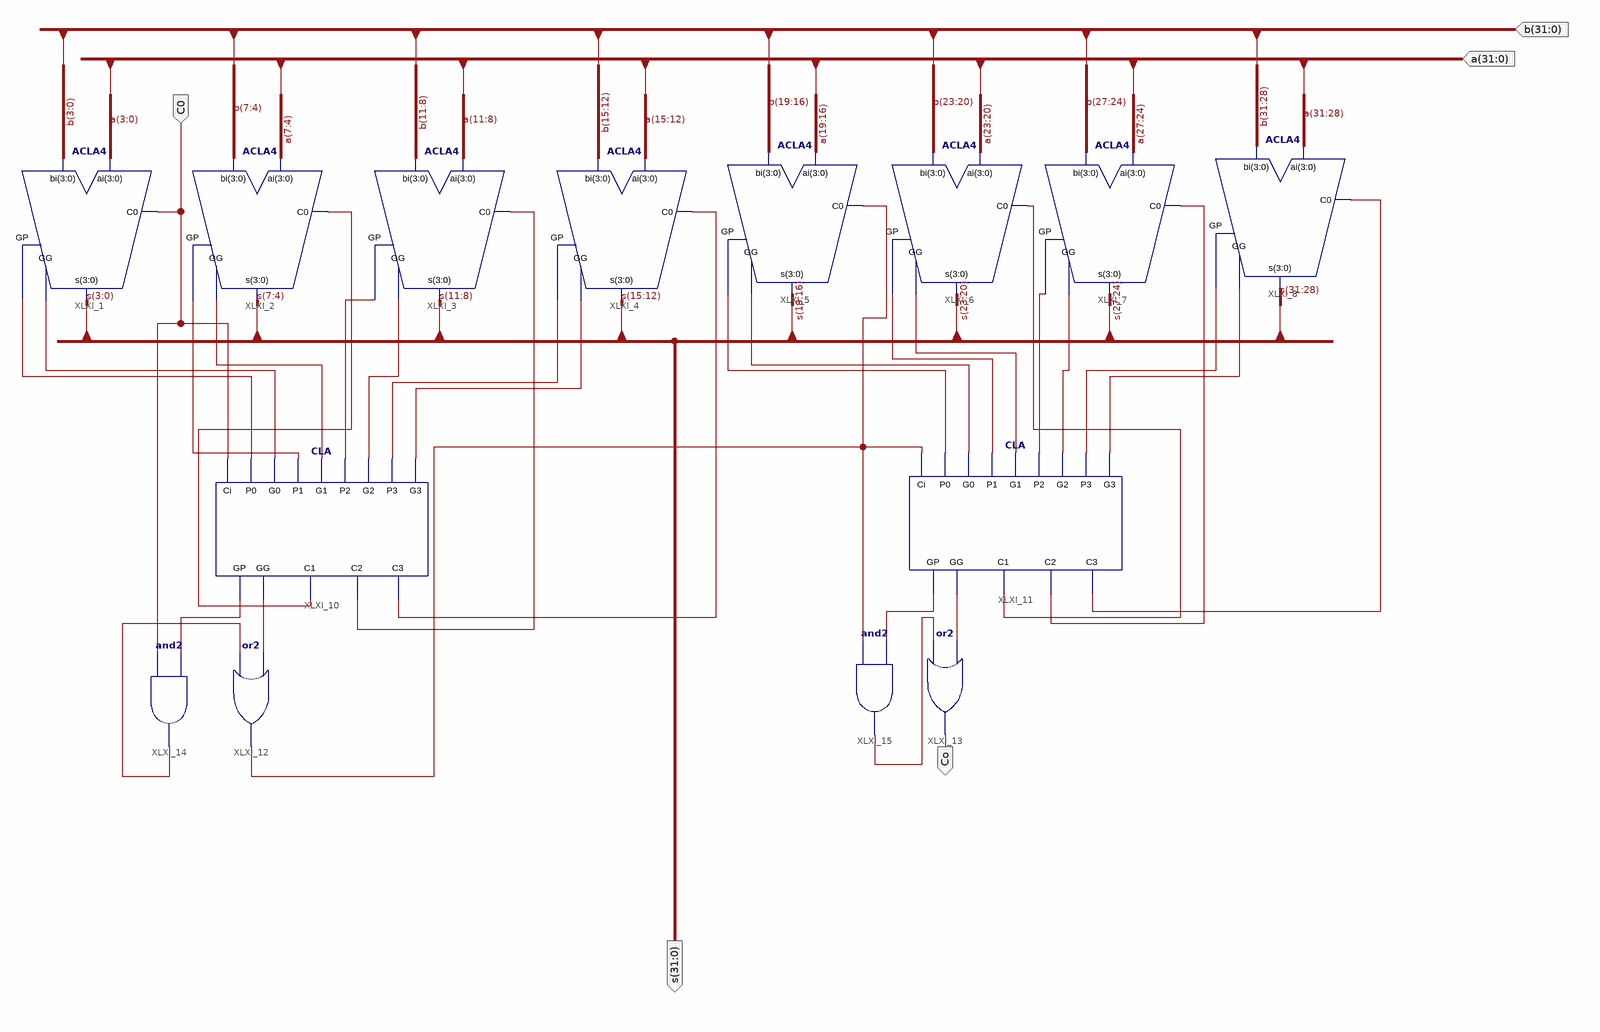
[diagram p0: schematic sheet 1]
// Xilinx ISE schematic ADC32.sch (kintex7) as structural Verilog: 14 symbols, 5 ports
module ADC32 (
  input  C0,
  input  [31:0] a,
  input  [31:0] b,
  output [31:0] s,
  output Co
);

  wire XLXN_1, XLXN_2, XLXN_3, XLXN_4, XLXN_5, XLXN_6, XLXN_7, XLXN_8, XLXN_13, XLXN_14, XLXN_15, XLXN_16,
       XLXN_17, XLXN_18, XLXN_19, XLXN_20, XLXN_21, XLXN_22, XLXN_23, XLXN_27, XLXN_28, XLXN_29, XLXN_30,
       XLXN_31, XLXN_32, XLXN_34, XLXN_35, XLXN_36, XLXN_37;

  ACLA4 XLXI_1 (.s(s[3:0]), .ai(a[3:0]), .bi(b[3:0]), .C0(C0), .GG(XLXN_2), .GP(XLXN_1));
  ACLA4 XLXI_2 (.s(s[7:4]), .ai(a[7:4]), .bi(b[7:4]), .C0(XLXN_29), .GG(XLXN_4), .GP(XLXN_3));
  ACLA4 XLXI_3 (.s(s[11:8]), .ai(a[11:8]), .bi(b[11:8]), .C0(XLXN_28), .GG(XLXN_6), .GP(XLXN_5));
  ACLA4 XLXI_4 (.s(s[15:12]), .ai(a[15:12]), .bi(b[15:12]), .C0(XLXN_27), .GG(XLXN_8), .GP(XLXN_7));
  ACLA4 XLXI_5 (.s(s[19:16]), .ai(a[19:16]), .bi(b[19:16]), .C0(XLXN_34), .GG(XLXN_14), .GP(XLXN_13));
  ACLA4 XLXI_6 (.s(s[23:20]), .ai(a[23:20]), .bi(b[23:20]), .C0(XLXN_23), .GG(XLXN_16), .GP(XLXN_15));
  ACLA4 XLXI_7 (.s(s[27:24]), .ai(a[27:24]), .bi(b[27:24]), .C0(XLXN_22), .GG(XLXN_18), .GP(XLXN_17));
  ACLA4 XLXI_8 (.s(s[31:28]), .ai(a[31:28]), .bi(b[31:28]), .C0(XLXN_21), .GG(XLXN_20), .GP(XLXN_19));
  CLA XLXI_10 (
    .G3(XLXN_8), .P3(XLXN_7), .G2(XLXN_6), .P0(XLXN_1), .Ci(C0), .G0(XLXN_2), .P2(XLXN_5), .G1(XLXN_4),
    .P1(XLXN_3), .C3(XLXN_27), .C2(XLXN_28), .C1(XLXN_29), .GP(XLXN_37), .GG(XLXN_35));
  CLA XLXI_11 (
    .G3(XLXN_20), .P3(XLXN_19), .G2(XLXN_18), .P0(XLXN_13), .Ci(XLXN_34), .G0(XLXN_14), .P2(XLXN_17),
    .G1(XLXN_16), .P1(XLXN_15), .C3(XLXN_21), .C2(XLXN_22), .C1(XLXN_23), .GP(XLXN_32), .GG(XLXN_31));
  or XLXI_12 (XLXN_34, XLXN_36, XLXN_35);
  or XLXI_13 (Co, XLXN_30, XLXN_31);
  and XLXI_14 (XLXN_36, C0, XLXN_37);
  and XLXI_15 (XLXN_30, XLXN_34, XLXN_32);
endmodule
